# Altium schematic sheet SCH_DS3231.SchDoc
size A3; SheetNumber: 3; SheetTotal: 10
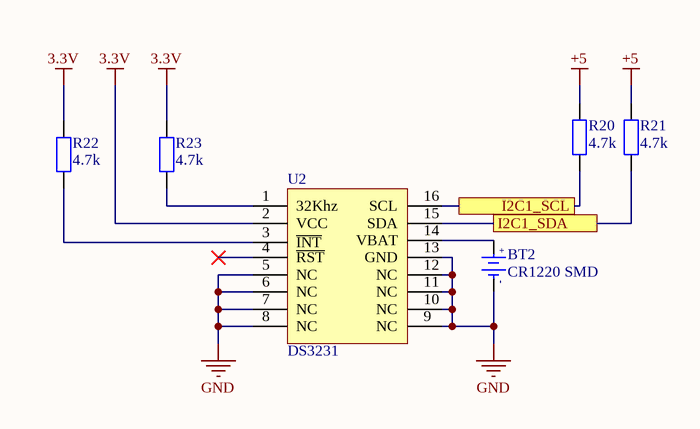
[diagram p0: SCH_DS3231.SchDoc]

## Parts
BT2  CR1220 SMD  [DE PIN CR1220]
R20  4.7k  [tro smd 0805]
R21  4.7k  [tro smd 0805]
R22  4.7k  [tro smd 0805]
R23  4.7k  [tro smd 0805]
U2  DS3231  [SOIC 16]

## Ports
I2C1_SCL, I2C1_SDA

## Nets
3.3V: R22.1 R23.2 U2.2(VCC)
+5: R20.1 R21.2
GND: BT2.2(GND) U2.5(NC) U2.6(NC) U2.7(NC) U2.8(NC) U2.9(NC) U2.10(NC) U2.11(NC) U2.12(NC) U2.13(GND)
I2C1_SCL: R20.2 U2.16(SCL) ; port I2C1_SCL
I2C1_SDA: R21.1 U2.15(SDA) ; port I2C1_SDA
NetBT2_1: BT2.1(+3V) U2.14(VBAT)
NetR22_2: R22.2 U2.3(~{INT})
NetR23_1: R23.1 U2.1(32Khz)

Not connected (* = marked no-connect by the designer): U2 4(~{RST})*

## Notes on the sheet
- (in symbol De pin CR1220 SMD) +; -

## Library data of the parts
BT2 = De pin CR1220 SMD: Ten: Đế PIN CR1220 SMD; Ma_Hang: MH000833
R20-R23 = Tro 0805 5% 4.7k: Dán; Don_Vi: Con; So_Chan: 2; Ten_Linh_Kien: Trở 0805 5% 4.7k; Ma_Hang: MH005307; Chung_Loai: Dán; Kieu_Chan: *
U2 = DS3231 SMD: SOIC